# Altium schematic sheet schemat.SchDoc
size A4
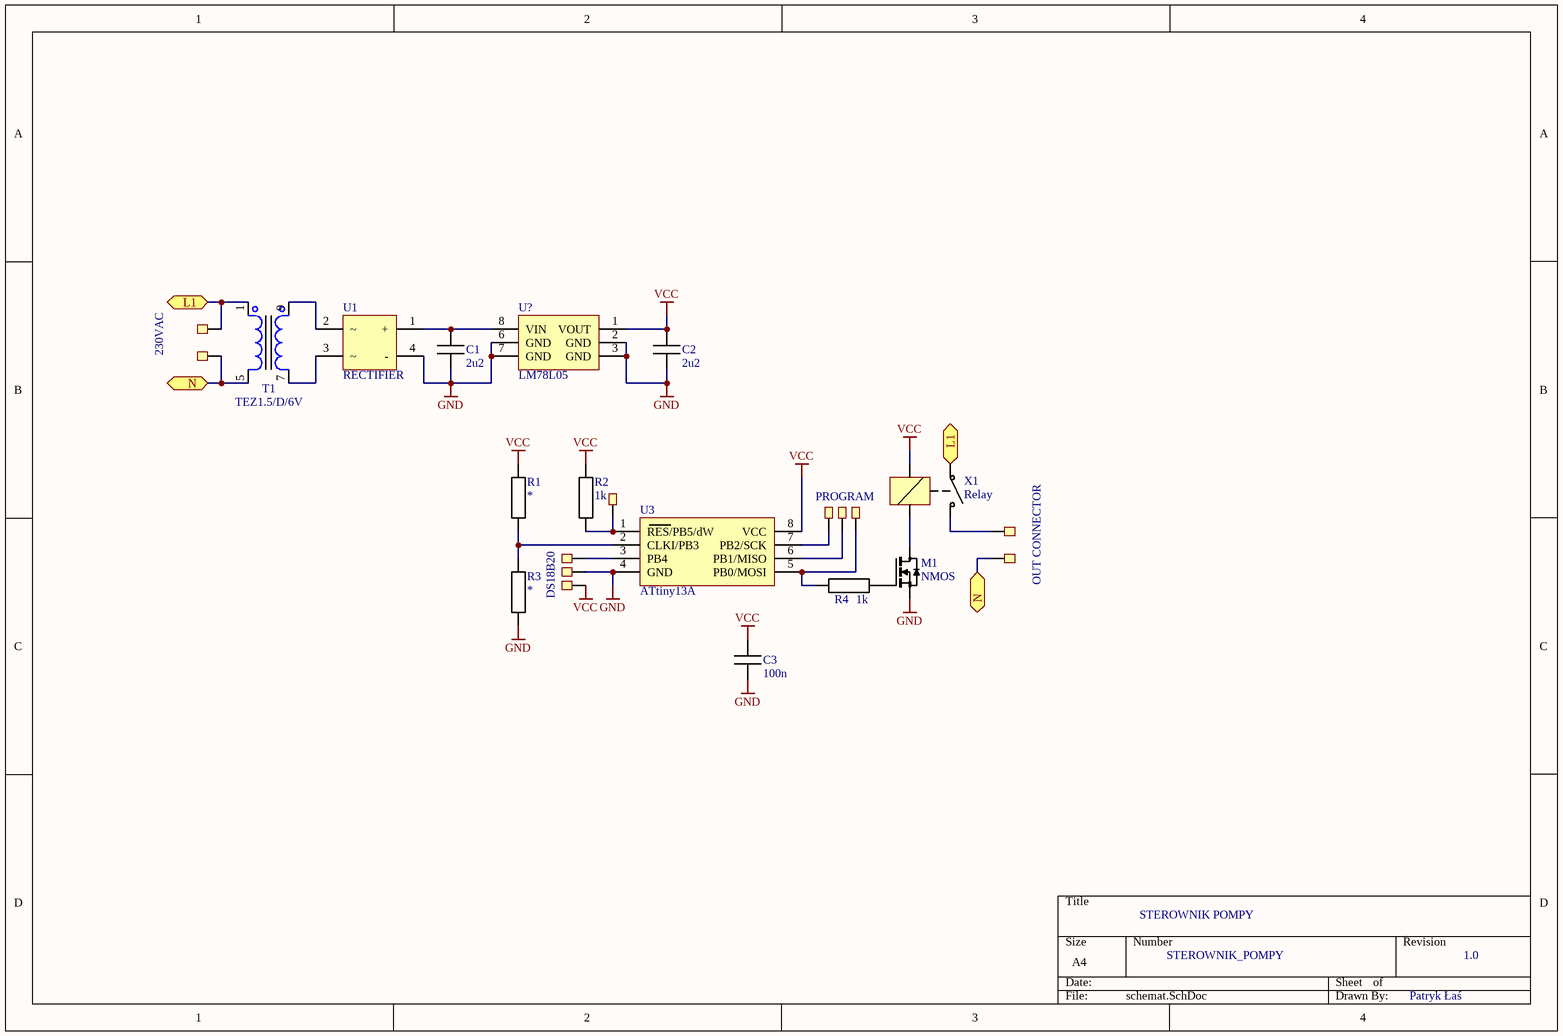
[diagram p0: schemat.SchDoc]

## Parts
C1  value 2u2  [1206C]  (hidden comment: Capacitor)
C2  value 2u2  [1206C]  (hidden comment: Capacitor)
C3  value 100n  [1206C]  (hidden comment: Capacitor)
M1  NMOS  [SOT23-3]
P1  PAD_THT  [PAD_2mm]  (value not drawn)
P2  PAD_THT  [PAD_2mm]  (value not drawn)
P3  PAD_THT  [PAD_0.8mm]  (value not drawn)
P4  PAD_THT  [PAD_0.8mm]  (value not drawn)
P5  PAD_THT  [PAD_0.8mm]  (value not drawn)
P6  PAD_THT  [PAD_0.8mm]  (value not drawn)
P7  PAD_THT  [PAD_2mm]  (value not drawn)
P8  PAD_THT  [PAD_0.8mm]  (value not drawn)
P9  PAD_THT  [PAD_2mm]  (value not drawn)
P10  PAD_THT  [PAD_0.8mm]  (value not drawn)
P11  PAD_THT  [PAD_0.8mm]  (value not drawn)
R1  Resistor  [1206R]  (value not drawn)
R2  value 1k  [1206R]  (hidden comment: Resistor)
R3  Resistor  [1206R]  (value not drawn)
R4  value 1k  [1206R]  (hidden comment: Resistor)
T1  TEZ1.5/D/6V  [TEZ1.6]
U1  RECTIFIER  [GBJ4]
U3  ATtiny13A  [SOIC8]
U?  LM78L05  [SOIC8]
X1  Relay  [JV-KT]

## Ports
L1, N

## Nets
GND: C1.1 C2.1 C3.1 M1.2(S) P10.1 R3.1 U1.4(-) U3.4(GND) U?.2(GND) U?.3(GND) U?.6(GND) U?.7(GND)
VCC: C2.2 C3.2 P11.1 R1.2 R2.2 U3.8(VCC) U?.1(VOUT) X1.4
L1: P1.1 T1.1 X1.3 ; port L1
N: P2.1 P9.1 T1.5 ; port N
NetC1_2: C1.2 U1.1(+) U?.8(VIN)
NetM1_1: M1.1(G) R4.2
NetM1_3: M1.3(D) X1.1
NetP3_1: P3.1 R2.1 U3.1(RES/PB5/dW)
NetP4_1: P4.1 U3.7(PB2/SCK)
NetP5_1: P5.1 U3.6(PB1/MISO)
NetP6_1: P6.1 R4.1 U3.5(PB0/MOSI)
NetP7_1: P7.1 X1.2
NetP8_1: P8.1 U3.3(PB4)
NetR1_1: R1.1 R3.2 U3.2(CLKI/PB3)
NetT1_7: T1.7 U1.3
NetT1_9: T1.9 U1.2

## Notes on the sheet
- 230VAC
- PROGRAM
- OUT CONNECTOR
- DS18B20
- STEROWNIK POMPY
- STEROWNIK_POMPY
- 1.0
- Patryk Łaś

## Library data of the parts
R1-R4 = Resistor
  R1 R3: Value: *